# Altium schematic sheet [4]_USB.SchDoc
size A3; DocumentNumber: 4; SheetNumber: 4; SheetTotal: 9; PageSetup: Record=PageOptions|CenterHorizontal=True|CenterVertical=True|PrintScale=0.97|XCorrection=1.00|YCorrection=1.00|PrintKind=1|BorderSize=5000000|LeftOffset=0|BottomOffset=0|Orientation=2|PaperLength=2970|PaperWidth=2100|Scale=100|PaperSource=7|PrintQuality=600|MediaType=1|DitherType=10|PaperKind=A4|PrintScaleMode=1
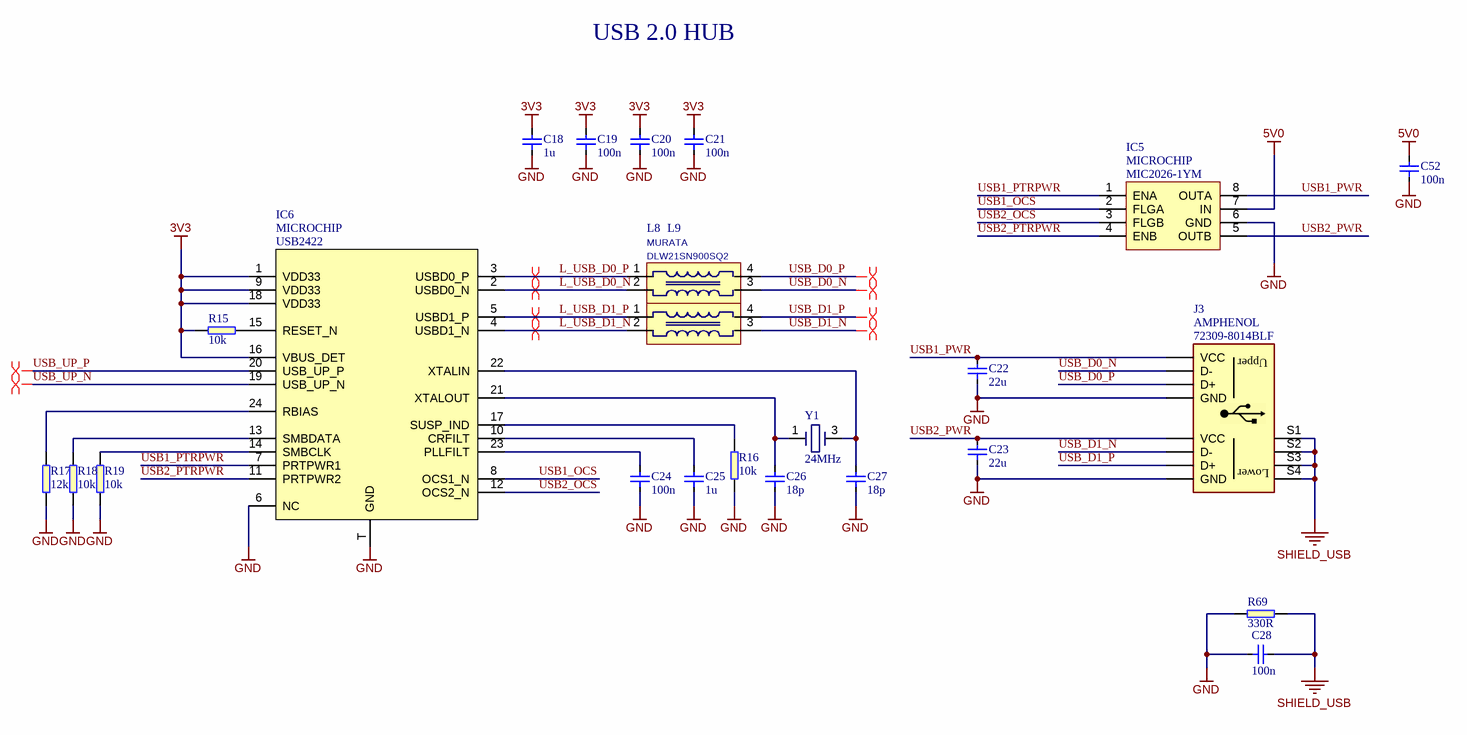
[diagram p0: [4]_USB.SchDoc]

## Parts
C18  1u  [0603]
C19  100n  [0402]
C20  100n  [0402]
C21  100n  [0402]
C22  22u  [0805]
C23  22u  [0805]
C24  100n  [0402]
C25  1u  [0603]
C26  18p  [0402]
C27  18p  [0402]
C28  100n  [0402]
C52  100n  [0402]
IC5  Manufacturer: MICROCHIP  [SOIC-8]  (hidden comment: MIC2026-1YM)
IC6  USB2422  Manufacturer: MICROCHIP  [QFN24]
J3  Manufacturer: AMPHENOL  Part Symbol: 72309-8014BLF  [T_MMMC_896-43-008-90-000000]
L8  Manufacturer: MURATA  [DLW21SN900SQ2]  (hidden comment: DLW21SN900SQ2)
L9  DLW21SN900SQ2  [DLW21SN900SQ2]  (value not drawn)
R15  10k  [0402]
R16  10k  [0402]
R17  12k  [0402]
R18  10k  [0402]
R19  10k  [0402]
R69  330R  [0402]
Y1  24MHz  [X1E0000210832]

## Nets
3V3: C18.2 C19.2 C20.2 C21.2 IC6.1(VDD33) IC6.9(VDD33) IC6.16(VBUS_DET) IC6.18(VDD33) R15.1
5V0: C52.2 IC5.7(IN)
GND: C18.1 C19.1 C20.1 C21.1 C22.1 C23.1 C24.1 C25.1 C26.1 C27.1 C28.1 C52.1 IC5.6(GND) IC6.6(NC) IC6.T(GND) J3.L4(GND) J3.U4(GND) R16.2 R17.1 R18.2 R19.2 R69.1 Y1.2 Y1.4
SHIELD_USB: C28.2 J3.S1 J3.S2 J3.S3 J3.S4 R69.2
L_USB_D0_N: IC6.2(USBD0_N) L8.2
L_USB_D0_P: IC6.3(USBD0_P) L8.1
L_USB_D1_N: IC6.4(USBD1_N) L9.2
L_USB_D1_P: IC6.5(USBD1_P) L9.1
USB1_OCS: IC5.2(FLGA) IC6.8(OCS1_N)
USB1_PTRPWR: IC5.1(ENA) IC6.7(PRTPWR1)
USB1_PWR: C22.2 IC5.8(OUTA) J3.U1(VCC)
USB2_OCS: IC5.3(FLGB) IC6.12(OCS2_N)
USB2_PTRPWR: IC5.4(ENB) IC6.11(PRTPWR2)
USB2_PWR: C23.2 IC5.5(OUTB) J3.L1(VCC)
USB_D0_N: J3.U2(D-) L8.3
USB_D0_P: J3.U3(D+) L8.4
USB_D1_N: J3.L2(D-) L9.3
USB_D1_P: J3.L3(D+) L9.4
USB_UP_N: IC6.19(USB_UP_N)
USB_UP_P: IC6.20(USB_UP_P)
NetC24_2: C24.2 IC6.23(PLLFILT)
NetC25_2: C25.2 IC6.10(CRFILT)
NetC26_2: C26.2 IC6.21(XTALOUT) Y1.1
NetC27_2: C27.2 IC6.22(XTALIN) Y1.3
NetIC6_13: IC6.13(SMBDATA) R18.1
NetIC6_14: IC6.14(SMBCLK) R19.1
NetIC6_15: IC6.15(RESET_N) R15.2
NetIC6_17: IC6.17(SUSP_IND) R16.1
NetIC6_24: IC6.24(RBIAS) R17.2

## Layout directives
differential pair: L_USB_D0_N, L_USB_D0_P, L_USB_D1_N, L_USB_D1_P, USB_D0_N, USB_D0_P, USB_D1_N, USB_D1_P, USB_UP_N, USB_UP_P

## Notes on the sheet
- USB 2.0 HUB
- Title:
- Size:
- Date:
- A3
- Revision:
- Page:
- of
- Antmicro Ltd.
- File:
- www.antmicro.com
- (in symbol USB_DOUBLE_A) Upper; Lower

## Library data of the parts
C18 C25 = C_1u_0603: MLCC SMT Capacitor 1u 0603; Manufacturer: MULTICOMP; Part Symbol: MC0603X105M6R3CT; Voltage: 6.3V; Tolerance: +-20%; Part Number: C_1u_0603; Value: 1u
C19-C21 C24 C28 C52 = C_100n_0402: MLCC SMT Capacitor 100nF 0402; Manufacturer: MULTICOMP; Part Symbol: MC0402X104M100CT; Voltage: 10V; Tolerance: +-20%; Value: 100n; Part Number: C_100n_0402
C22 C23 = C_22u_0805: MLCC SMT Capacitor 22uF 0805; Manufacturer: MULTICOMP; Part Symbol: MC0805X226M6R3CT; Voltage: 6.3V; Tolerance: +-20%; Part Number: C_22u_0805; Value: 22u
C26 C27 = C_18p_0402: MLCC SMT Capacitor 18pF 0402; Manufacturer: KEMET; Part Symbol: C0402C180J5GACAUTO; Voltage: 50V; Tolerance: +-5%; Part Number: C_18p_0402; Value: 18p
IC5 = MIC2026-1YM: Power Load Distribution Switch IC, Active High, 2 Outputs, 5.5 V in, 900 mA, 0.09 ohm, SOIC-8; Part Number: MIC2026-1YM; Value: MIC2026-1YM; Part Symbol: MIC2026-1YM
IC6 = USB2422: The USB2422-I/MJ is a 2-port USB 2.0 high-speed Hub Controller IC with two downstream ports for embedded USB solutions.; Part Number: USB2422; Value: USB2422; Part Symbol: USB2422-I/MJ
J3 = USB_DOUBLE_A: 8-way 2-port USB 2.0 type-A Stacked Connector with gold-plated copper alloy contacts.; Part Number: USB_DOUBLE_A
L8 = DLW21SN900SQ2: Common mode choke; Part Symbol: DLW21SN900SQ2L; Part Number: DLW21SN900SQ2; Value: DLW21SN900SQ2
L9 = DLW21SN900SQ2: Common mode choke; Manufacturer: MURATA; Part Symbol: DLW21SN900SQ2L; Part Number: DLW21SN900SQ2; Value: DLW21SN900SQ2
R15 R16 R18 R19 = R_10k_0402: SMT Resistor 10k 0402; Manufacturer: MULTICOMP; Part Symbol: MCMR04X1002FTL; Tolerance: 1%; Part Number: R_10k_0402; Value: 10k
R17 = R_12k_0402: SMT Resistor 12k 0402; Manufacturer: VISHAY; Part Symbol: CRCW040212K0FKEDHP; Tolerance: 1%; Part Number: R_12k_0402; Value: 12k
R69 = R_330R_0402: SMT Resistor 330R 0402; Manufacturer: MULTICOMP; Part Symbol: MCMR04X3300FTL; Tolerance: 1%; Part Number: R_330R_0402; Value: 330R
Y1 = CRYSTAL_SMD_24Mhz: Crystal, 24 MHz, SMD, 3.2mm x 2.5mm, 10 ppm, 18 pF, 10 ppm, TSX-3225 Series; Part Number: CRYSTAL_24MHz_3.2mm x2.5mm; Manufacturer: EPSON; Part Symbol: X1E0000210832 TSX-3225 24MHZ; Value: 24MHz